# Altium schematic sheet CNY70.SchDoc
size A4; SheetNumber: 5; SheetTotal: 6
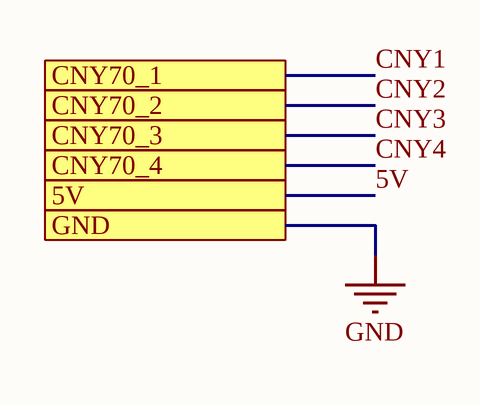
[diagram p0: CNY70.SchDoc]

## Ports
5V, CNY70_1, CNY70_2, CNY70_3, CNY70_4, GND

## Nets
GND: port GND
5V: port 5V
CNY1: port CNY70_1
CNY2: port CNY70_2
CNY3: port CNY70_3
CNY4: port CNY70_4